# Altium project PCI_board_universal.PrjPCB (part 2 of 2)
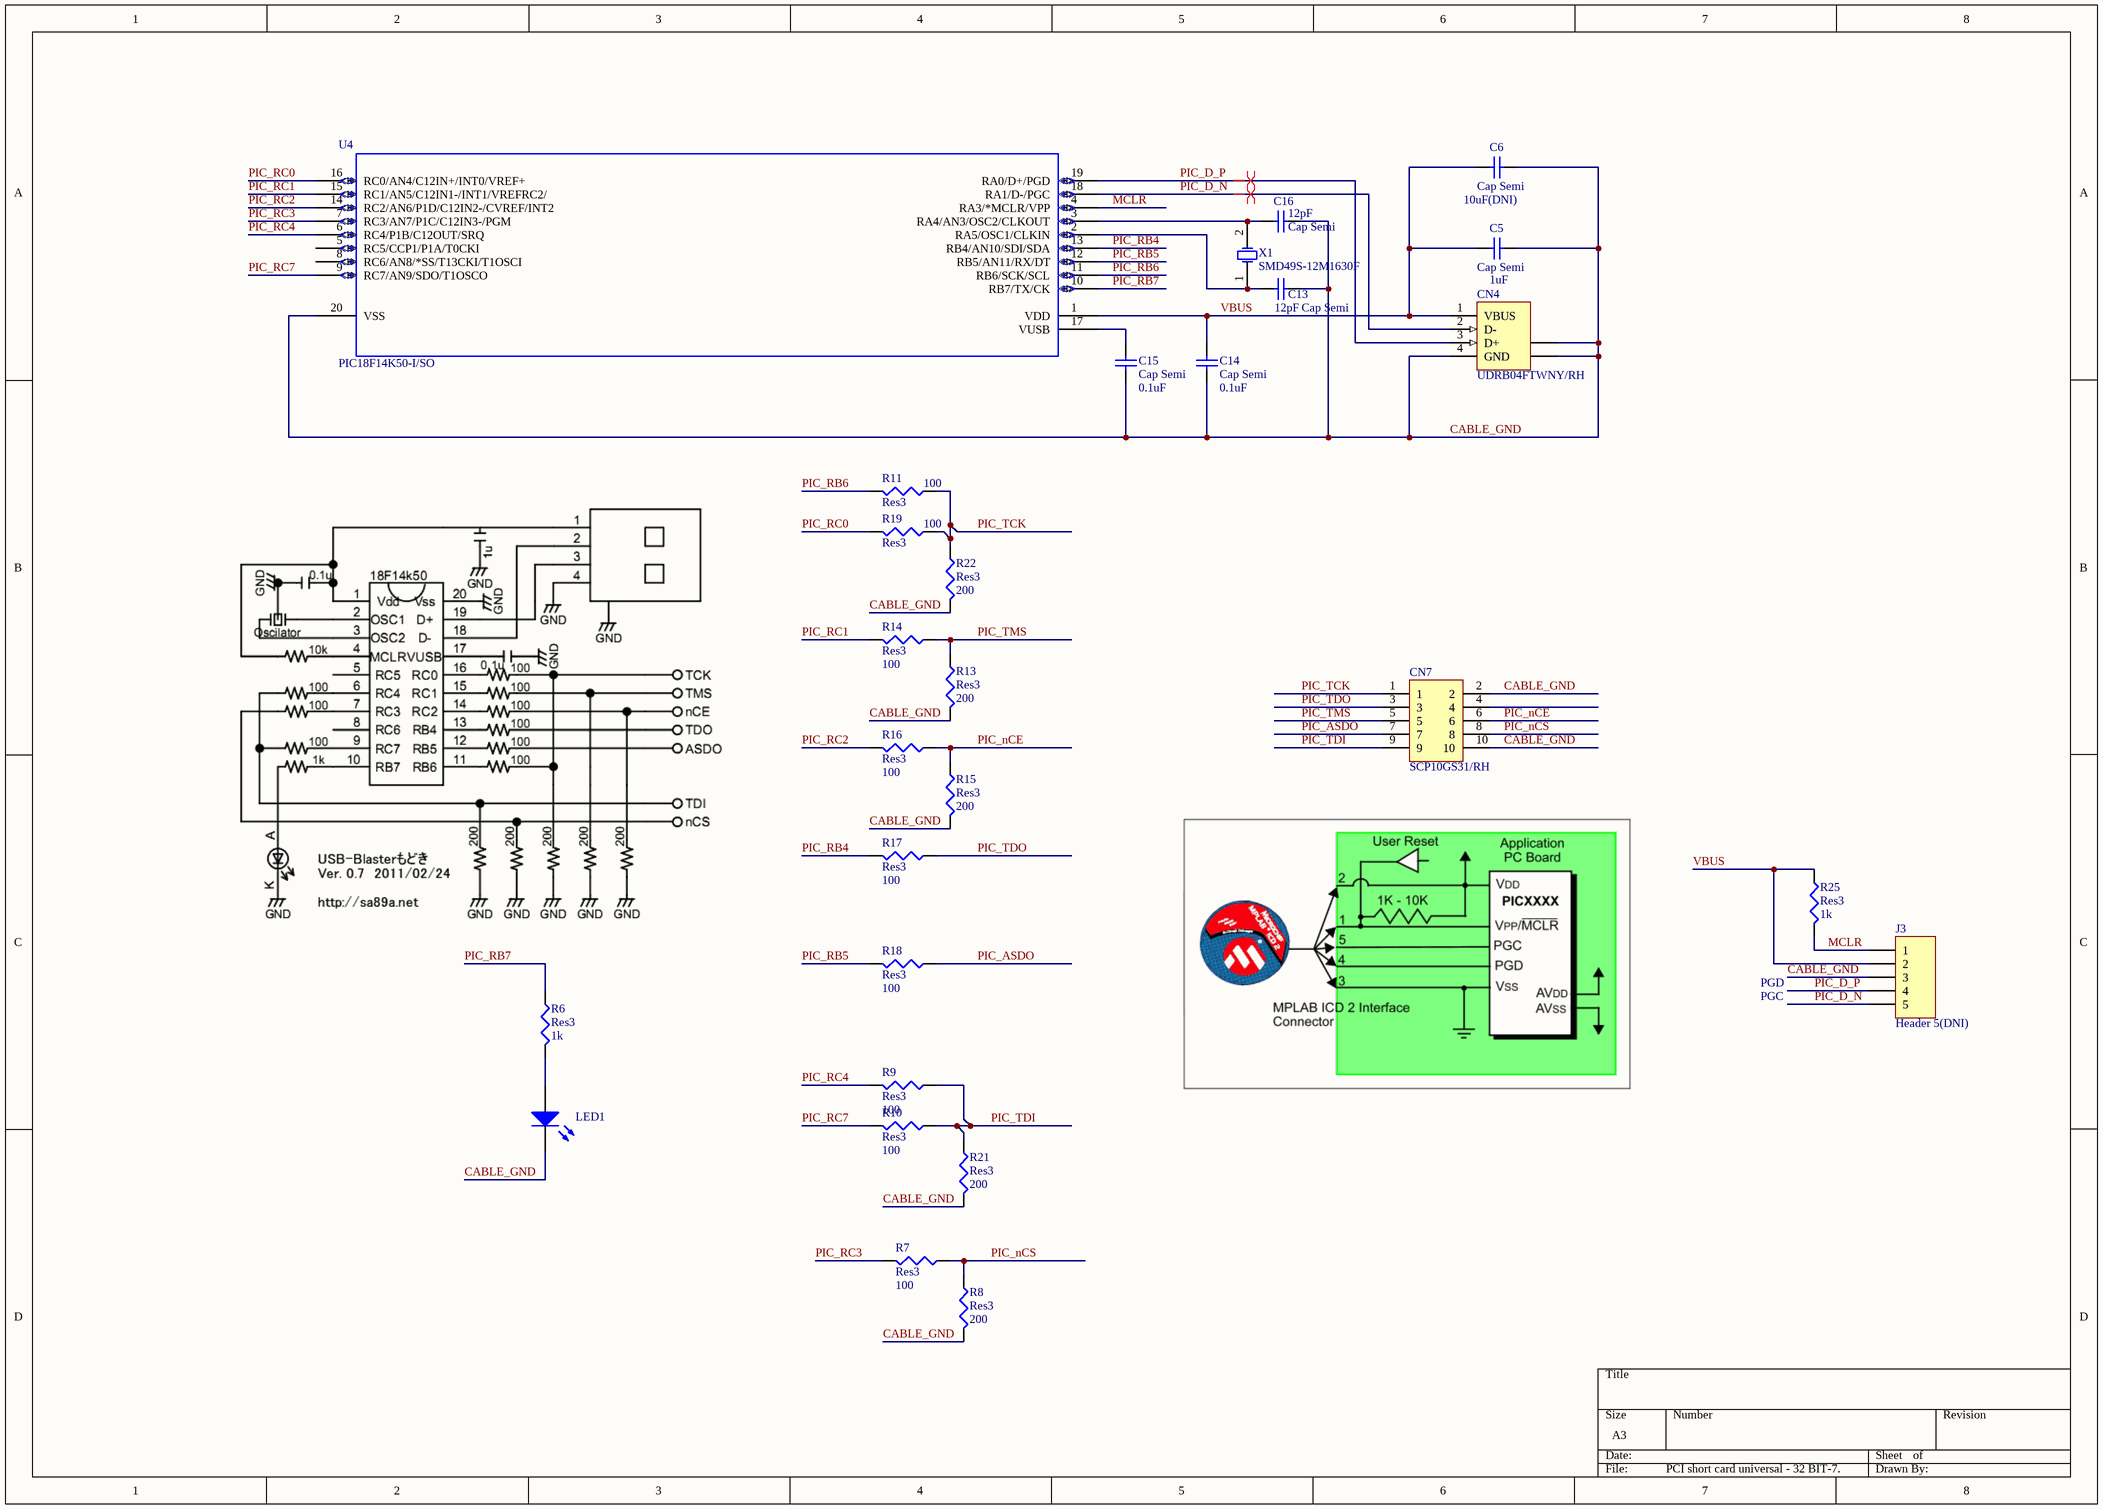
[diagram p7: PCI short card universal - 32 BIT-7.schdoc]

## Nets that join several sheets
3_3V: PCI short card universal - 32 BIT-2 (23 pins), PCI short card universal - 32 BIT-3 (40 pins), PCI short card universal - 32 BIT-4 (15 pins), PCI short card universal - 32 BIT-5 (10 pins), PCI short card universal - 32 BIT-6 (20 pins)
GND: PCI short card universal - 32 BIT (39 pins), PCI short card universal - 32 BIT-2 (28 pins), PCI short card universal - 32 BIT-3 (74 pins), PCI short card universal - 32 BIT-4 (15 pins), PCI short card universal - 32 BIT-5 (28 pins), PCI short card universal - 32 BIT-6 (23 pins)
+3.3V: PCI short card universal - 32 BIT (13 pins), PCI short card universal - 32 BIT-3 (J5.3 TP4.1)
ADC_CLK: PCI short card universal - 32 BIT (U8.37), PCI short card universal - 32 BIT-6 (J2.3 U1.13)
ADC_CS: PCI short card universal - 32 BIT (U8.41), PCI short card universal - 32 BIT-6 (J2.2 U1.10)
ADC_DIN: PCI short card universal - 32 BIT (U8.40), PCI short card universal - 32 BIT-6 (J2.1 U1.11)
ADC_DOUT: PCI short card universal - 32 BIT (U8.39), PCI short card universal - 32 BIT-6 (J2.4 U1.12)
CONF_ASDO: PCI short card universal - 32 BIT (U8.1), PCI short card universal - 32 BIT-2 (CN6.9 U6.5)
CONF_nCSO: PCI short card universal - 32 BIT (U8.2), PCI short card universal - 32 BIT-2 (CN6.8 U6.1)
DAC_CLK: PCI short card universal - 32 BIT (U8.35), PCI short card universal - 32 BIT-6 (J2.5 U2.4 U3.4)
DAC_CS1: PCI short card universal - 32 BIT (U8.32), PCI short card universal - 32 BIT-6 (J2.9 U3.3)
DAC_CS2: PCI short card universal - 32 BIT (U8.36), PCI short card universal - 32 BIT-6 (J2.6 U2.3)
DAC_DATA: PCI short card universal - 32 BIT (U8.34), PCI short card universal - 32 BIT-6 (J2.8 U2.5 U3.5)
DAC_LDAC: PCI short card universal - 32 BIT (U8.33), PCI short card universal - 32 BIT-6 (J2.7 U2.8 U3.8)
DIGITAL_D0: PCI short card universal - 32 BIT-4 (U8.206), PCI short card universal - 32 BIT-5 (CN3.18 J1.18)
DIGITAL_D1: PCI short card universal - 32 BIT-4 (U8.207), PCI short card universal - 32 BIT-5 (CN3.17 J1.17)
DIGITAL_D2: PCI short card universal - 32 BIT-4 (U8.208), PCI short card universal - 32 BIT-5 (CN3.16 J1.16)
DIGITAL_D3: PCI short card universal - 32 BIT (U8.3), PCI short card universal - 32 BIT-5 (CN3.15 J1.15)
DIGITAL_D4: PCI short card universal - 32 BIT (U8.4), PCI short card universal - 32 BIT-5 (CN3.14 J1.14)
DIGITAL_D5: PCI short card universal - 32 BIT (U8.5), PCI short card universal - 32 BIT-5 (CN3.13 J1.13)
DIGITAL_D6: PCI short card universal - 32 BIT (U8.6), PCI short card universal - 32 BIT-5 (CN3.12 J1.12)
DIGITAL_D7: PCI short card universal - 32 BIT (U8.8), PCI short card universal - 32 BIT-5 (CN3.11 J1.11)
DIGITAL_D8: PCI short card universal - 32 BIT (U8.10), PCI short card universal - 32 BIT-5 (CN3.10 J1.10)
DIGITAL_D9: PCI short card universal - 32 BIT (U8.11), PCI short card universal - 32 BIT-5 (CN3.9 J1.9)
DIGITAL_D10: PCI short card universal - 32 BIT (U8.12), PCI short card universal - 32 BIT-5 (CN3.8 J1.8)
DIGITAL_D11: PCI short card universal - 32 BIT (U8.13), PCI short card universal - 32 BIT-5 (CN3.7 J1.7)
DIGITAL_D12: PCI short card universal - 32 BIT (U8.14), PCI short card universal - 32 BIT-5 (CN3.6 J1.6)
DIGITAL_D13: PCI short card universal - 32 BIT (U8.15), PCI short card universal - 32 BIT-5 (CN3.5 J1.5)
DIGITAL_D14: PCI short card universal - 32 BIT (U8.30), PCI short card universal - 32 BIT-5 (CN3.4 J1.4)
DIGITAL_D15: PCI short card universal - 32 BIT (U8.31), PCI short card universal - 32 BIT-5 (CN3.3 J1.3)
FLASH_ASDI: PCI short card universal - 32 BIT (U8.117), PCI short card universal - 32 BIT-5 (U13.5)
FLASH_DATA: PCI short card universal - 32 BIT (U8.115), PCI short card universal - 32 BIT-5 (U13.2)
FLASH_DCLK: PCI short card universal - 32 BIT (U8.116), PCI short card universal - 32 BIT-5 (U13.6)
FLASH_nCS: PCI short card universal - 32 BIT (U8.114), PCI short card universal - 32 BIT-5 (U13.1)
FPGA_RESET: PCI short card universal - 32 BIT (U8.118), PCI short card universal - 32 BIT-2 (C33.2 R46.2 S5.1 S5.2)
LPCI_CLK: PCI short card universal - 32 BIT (U5.22), PCI short card universal - 32 BIT-2 (U8.28)
SDRAM_A6: PCI short card universal - 32 BIT (U8.152), PCI short card universal - 32 BIT-4 (U10.31)
SDRAM_A7: PCI short card universal - 32 BIT (U8.151), PCI short card universal - 32 BIT-4 (U10.32)
SDRAM_A8: PCI short card universal - 32 BIT (U8.150), PCI short card universal - 32 BIT-4 (U10.33)
SDRAM_A9: PCI short card universal - 32 BIT (U8.149), PCI short card universal - 32 BIT-4 (U10.34)
SDRAM_A11: PCI short card universal - 32 BIT (U8.147), PCI short card universal - 32 BIT-4 (U10.35)
SDRAM_A12: PCI short card universal - 32 BIT (U8.146), PCI short card universal - 32 BIT-4 (U10.36)
SDRAM_CKE: PCI short card universal - 32 BIT (U8.145), PCI short card universal - 32 BIT-4 (U10.37)
SDRAM_CLK: PCI short card universal - 32 BIT (U8.144), PCI short card universal - 32 BIT-4 (U10.38)
SW1: PCI short card universal - 32 BIT (U8.127), PCI short card universal - 32 BIT-2 (R41.2 S6.1 S6.2)
SW2: PCI short card universal - 32 BIT (U8.128), PCI short card universal - 32 BIT-2 (R42.2 S7.1 S7.2)
SW6: PCI short card universal - 32 BIT-2 (S4.2), PCI short card universal - 32 BIT-4 (U8.205)
SW8: PCI short card universal - 32 BIT (U8.133), PCI short card universal - 32 BIT-2 (R43.2 S8.1 S8.2)
UART_RX: PCI short card universal - 32 BIT (U8.119), PCI short card universal - 32 BIT-5 (LED11.2 U15.12)
UART_TX: PCI short card universal - 32 BIT (U8.120), PCI short card universal - 32 BIT-5 (LED10.2 U15.11)
VGA_B: PCI short card universal - 32 BIT (U8.138), PCI short card universal - 32 BIT-5 (R38.1 R50.1)
VGA_B_2: PCI short card universal - 32 BIT (U8.137), PCI short card universal - 32 BIT-5 (R37.1 R51.1)
VGA_G: PCI short card universal - 32 BIT (U8.141), PCI short card universal - 32 BIT-5 (R33.1 R47.1)
VGA_G_2: PCI short card universal - 32 BIT (U8.139), PCI short card universal - 32 BIT-5 (R35.1 R48.1)
VGA_HSYNC: PCI short card universal - 32 BIT (U8.135), PCI short card universal - 32 BIT-5 (R40.1 R52.1)
VGA_R: PCI short card universal - 32 BIT (U8.143), PCI short card universal - 32 BIT-5 (R32.1 R36.1)
VGA_R_2: PCI short card universal - 32 BIT (U8.142), PCI short card universal - 32 BIT-5 (R34.1 R39.1)
VGA_VSYNC: PCI short card universal - 32 BIT (U8.134), PCI short card universal - 32 BIT-5 (R44.1 R53.1)